# EAGLE design AtMega (EAGLE 9.5.2)
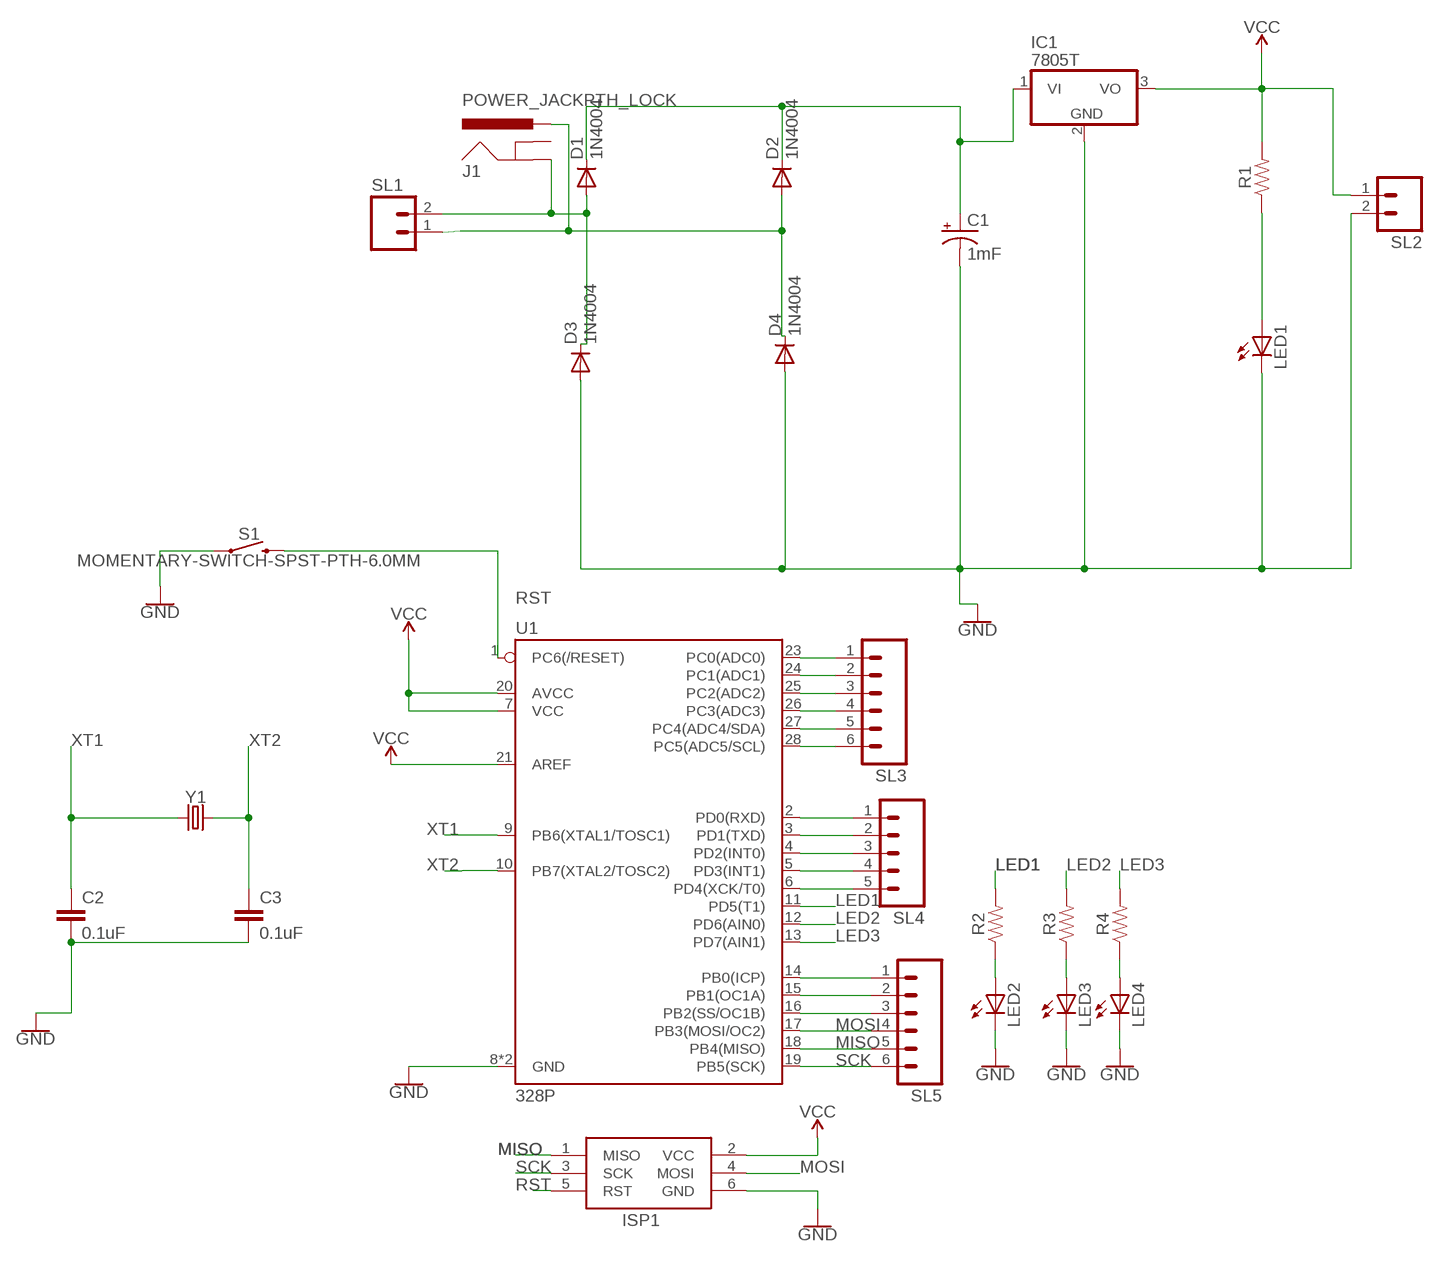
[diagram p0: schematic, sheet 1]

## Parts
C1  1mF  1000UF-RADIAL-5MM-25V-20%  [CPOL-RADIAL-5MM-10MM]
C2  0.1uF  0.1UF-KIT-EZ-50V-20%  [CAP-PTH-SMALL-KIT]
C3  0.1uF  0.1UF-KIT-EZ-50V-20%  [CAP-PTH-SMALL-KIT]
D1  1N4004  [DO41-10]
D2  1N4004  [DO41-10]
D3  1N4004  [DO41-10]
D4  1N4004  [DO41-10]
IC1  7805T  [TO220H]
ISP1  AVRISP-6  [AVRISP]
J1  POWER_JACKPTH_LOCK  [POWER_JACK_PTH_LOCK]
LED1  LED5MM  [LED5MM]
LED2  LED3MM  [LED3MM]
LED3  LED3MM  [LED3MM]
LED4  LED3MM  [LED3MM]
R1  RESISTORAXIAL-0.3  [AXIAL-0.3]
R2  RESISTORAXIAL-0.3  [AXIAL-0.3]
R3  RESISTORAXIAL-0.3  [AXIAL-0.3]
R4  RESISTORAXIAL-0.3  [AXIAL-0.3]
S1  MOMENTARY-SWITCH-SPST-PTH-6.0MM  [TACTILE_SWITCH_PTH_6.0MM]
SL1  M02  [02P]
SL2  M02  [02P]
SL3  M06  [06P]
SL4  M05  [05P]
SL5  M06  [06P]
U1  328P  ATMEGA328P_PDIP  [DIP28]
Y1  CRYSTALPTH-HC49US  [HC49US]

## Nets
GND: C1.- C2.2 C3.2 D3.A IC1.2(GND) ISP1.6(GND) LED1.K(C) LED2.K(C) LED3.K(C) LED4.K(C) S1.1 SL2.2 U1.8(GND) U1.22(GND)
LED1: R2.P$2 U1.11(PD5(T1))
LED2: R3.P$2 U1.12(PD6(AIN0))
LED3: R4.P$2 U1.13(PD7(AIN1))
MISO: ISP1.1(MISO) SL5.5 U1.18(PB4(MISO))
MOSI: ISP1.4(MOSI) SL5.4 U1.17(PB3(MOSI/OC2))
N$1: D2.A D4.C J1.PWR SL1.1
N$2: D4.A
N$3: SL5.3 U1.16(PB2(SS/OC1B))
N$4: LED4.A R4.P$1
N$5: C1.+ D1.C D2.C IC1.1(VI)
N$6: D1.A D3.C SL1.2
N$7: LED1.A R1.P$1
N$8: J1.GND
N$9: LED3.A R3.P$1
N$10: LED2.A R2.P$1
N$11: SL3.1 U1.23(PC0(ADC0))
N$12: SL3.2 U1.24(PC1(ADC1))
N$13: SL3.3 U1.25(PC2(ADC2))
N$14: SL3.4 U1.26(PC3(ADC3))
N$15: SL3.5 U1.27(PC4(ADC4/SDA))
N$16: SL3.6 U1.28(PC5(ADC5/SCL))
N$17: SL4.1 U1.2(PD0(RXD))
N$18: SL4.2 U1.3(PD1(TXD))
N$19: SL4.3 U1.4(PD2(INT0))
N$20: SL4.4 U1.5(PD3(INT1))
N$21: SL4.5 U1.6(PD4(XCK/T0))
N$22: SL5.1 U1.14(PB0(ICP))
N$23: SL5.2 U1.15(PB1(OC1A))
RST: ISP1.5(RST) S1.3 U1.1(PC6(/RESET))
SCK: ISP1.3(SCK) SL5.6 U1.19(PB5(SCK))
VCC: IC1.3(VO) ISP1.2(VCC) R1.P$2 SL2.1 U1.7(VCC) U1.20(AVCC) U1.21(AREF)
XT1: C2.1 U1.9(PB6(XTAL1/TOSC1)) Y1.1
XT2: C3.1 U1.10(PB7(XTAL2/TOSC2)) Y1.2
Unconnected: J1.GNDBREAK

## Library data of the parts
C1 = SparkFun-Capacitors:1000UF: 1,000µF/1mF ceramic capacitors A capacitor is a passive two-terminal electrical component used to store electrical energy temporarily in an electric field. CAP-08070; PROD_ID: CAP-09538
C2 C3 = SparkFun-Capacitors:0.1UF: 0.1µF ceramic capacitors A capacitor is a passive two-terminal electrical component used to store electrical energy temporarily in an electric field.; PROD_ID: CAP-08370
D1-D4 = adafruit:1N4004: DIODE General purpose 1N400x type rectifier (With bigger pads) http://www.ladyada.net/library/pcb/eaglelibrary.html
IC1 = adafruit:78*: Positive VOLTAGE REGULATOR Added bigger pads to the TO-92 package
ISP1 = adafruit:AVRISP: AVR ISP HEADER Standard 6 pin header for AVR programming
J1 = SparkFun-Connectors:POWER_JACK: Power Jack Connector This is the standard 5.5mm barrel jack for power. The PTH is the most common, proven, reliable, footprint. The Slot footprint only works if the mill layer is transmitted to the PCB fab house so be warned. Here are the connectors we sell at SparkFun: DC Barrel Power Jack/Connector <https://www.sparkfun.com/products/119> (PRT-00119) DC Barrel Power Jack/Connector (SMD) <https://www.sparkfun.com/products/12748> (PRT-12748) DC Barrel Jack Adapter - Breadboard Compatible <https://www.sparkfun.com/products/10811> (PRT-10811) It is used on this SparkFun product (and many, many others): SparkFun RedBoard - Programmed with Arduino <https://www.sparkfun.com/products/12757> (DEV-12757) Also, if you need a mating power supply or connector, please check these out: Wall Adapter Power Supply - 9VDC 650mA <https://www.sparkfun.com/products/298> (TOL-00298) DC Barrel Jack Adapter - Male <https://www.sparkfun.com/products/10287> (PRT-10287); PROD_ID: CONN-08197; SF_ID: PRT-00119
LED1-LED4 = adafruit:LED: LED OSRAM: - CHIPLED LG R971, LG N971, LY N971, LG Q971, LY Q971, LO R971, LY R971 LH N974, LH R974 LS Q976, LO Q976, LY Q976 LO Q996 - Hyper CHIPLED LW Q18S LB Q993, LB Q99A, LB R99A - SideLED LS A670, LO A670, LY A670, LG A670, LP A670 LB A673, LV A673, LT A673, LW A673 LH A674 LY A675 LS A676, LA A676, LO A676, LY A676, LW A676 LS A679, LY A679, LG A679 - Hyper Micro SIDELED® LS Y876, LA Y876, LO Y876, LY Y876 LT Y87S - SmartLED LW L88C, LW L88S LB L89C, LB L89S, LG L890 LS L89K, LO L89K, LY L89K LS L896, LA L896, LO L896, LY L896 - TOPLED LS T670, LO T670, LY T670, LG T670, LP T670 LSG T670, LSP T670, LSY T670, LOP T670, LYG T670 LG T671, LOG T671, LSG T671 LB T673, LV T673, LT T673, LW T673 LH T674 LS T676, LA T676, LO T676, LY T676, LB T676, LH T676, LSB T676, LW T676 LB T67C, LV T67C, LT T67C, LS T67K, LO T67K, LY T67K, LW E67C LS E67B, LA E67B, LO E67B, LY E67B, LB E67C, LV E67C, LT E67C LW T67C LS T679, LY T679, LG T679 LS T770, LO T770, LY T770, LG T770, LP T770 LB T773, LV T773, LT T773, LW T773 LH T774 LS E675, LA E675, LY E675, LS T675 LS T776, LA T776, LO T776, LY T776, LB T776 LHGB T686 LT T68C, LB T68C - Hyper Mini TOPLED® LB M676 - Mini TOPLED Santana® LG M470 LS M47K, LO M47K, LY M47K Source: http://www.osram.convergy.de/
R1-R4 = SparkFun-Resistors:RESISTOR: Generic Resistor Package
S1 = SparkFun-Switches:MOMENTARY-SWITCH-SPST: Momentary Switch (Pushbutton) - SPST Normally-open (NO) SPST momentary switches (buttons, pushbuttons). Variants PTH-12MM - 12mm square, through-hole Momentary Pushbutton Switch - 12mm Square <https://www.sparkfun.com/products/9190> (COM-09190) PTH-6.0MM, PTH-6.0MM-KIT - 6.0mm square, through-hole Mini Pushbutton Switch <https://www.sparkfun.com/products/97> (COM-00097) KIT package intended for soldering kit's - only one side of pads' copper is exposed. PTH-RIGHT-ANGLE-KIT - Right-angle, through-hole Right Angle Tactile Button <https://www.sparkfun.com/products/10791> - Used on SparkFun BigTime Watch Kit <https://www.sparkfun.com/products/11734> SMD-12MM - 12mm square, surface-mount Tactile Button - SMD (12mm) <https://www.sparkfun.com/products/12993> (COM-12993) Used on SparkFun PicoBoard <https://www.sparkfun.com/products/11888> SMD-4.5MM - 4.5mm Square Trackball Switch Used on SparkFun Blackberry Trackballer Breakout <https://www.sparkfun.com/products/13169> SMD-4.6MMX2.8MM - 4.60mm x 2.80mm, surface mount Used on SparkFun SAMD21 Mini Breakout <https://www.sparkfun.com/products/13664> SMD-5.2MM, SMD-5.2-REDUNDANT - 5.2mm square, surface-mount Mini Pushbutton Switch - SMD <https://www.sparkfun.com/products/8720> (COM-08720) Used on Arduino Pro Mini <https://www.sparkfun.com/products/11114> REDUNDANT package connects both switch circuits together SMD-6.0X3.5MM - 6.0 x 3.5mm, surface mount Momentary Reset Switch SMD <https://www.sparkfun.com/products/8229> (COM-08229) SMD-6.2MM-TALL - 6.2mm square, surface mount Tactile Button - SMD (6mm) <https://www.sparkfun.com/products/12992> Used on SparkFun Digital Sandbox <https://www.sparkfun.com/products/12651> SMD-RIGHT-ANGLE - Right-angle, surface mount Used on SparkFun Block for Intel® Edison - Arduino <https://www.sparkfun.com/products/13036>; PROD_ID: SWCH-08441; SF_SKU: COM-00097
SL1 SL2 = con-amp-quick:M02: AMP QUICK CONNECTOR; OC_FARNELL: unknown; OC_NEWARK: unknown
SL3 SL5 = con-amp-quick:M06: AMP QUICK CONNECTOR; OC_FARNELL: unknown; OC_NEWARK: unknown
SL4 = con-amp-quick:M05: AMP QUICK CONNECTOR; OC_FARNELL: unknown; OC_NEWARK: unknown
U1 = SparkFun-IC-Microcontroller:ATMEGA328P_PDIP: Atmel 328P Through hole ATMEGA328P uC used in the Arduino 32kb flash, 1k EEPROM, 2k SRAM Datasheet <http://www.sparkfun.com/datasheets/Components/SMD/ATMega328.pdf> SparkFun Products Storefront component: AVR 28 Pin 20MHz 32K 6A/D - ATMega328P <https://www.sparkfun.com/products/9061> (COM-09061) SparkFun Simon Says - Through-Hole Soldering Kit <https://www.sparkfun.com/products/10547> (KIT-10547) SparkFun Learn to Solder - Simon Says <https://www.sparkfun.com/products/13708> (KIT-13708) SparkFun BigTime Watch Kit <https://www.sparkfun.com/products/11734> (KIT-11734) SparkFun ClockIt <https://www.sparkfun.com/products/10930> (KIT-10930) SparkFun Serial Enabled LCD Kit <https://www.sparkfun.com/products/10097> (LCD-10097) SparkFun Simon Tilts - Through Hole Soldering Kit <https://www.sparkfun.com/products/12634> (KIT-12634) SparkFun Frequency Counter Kit <https://www.sparkfun.com/products/10140> (KIT-10140) FabFM Radio Kit <https://www.sparkfun.com/products/11043> (KIT-11043) SparkFun Binary Blaster Kit <https://www.sparkfun.com/products/12037> (KIT-12037) SparkFun Metro-Gnome <https://www.sparkfun.com/products/9236> (KIT-09236) ATmega328 with Arduino Optiboot (Uno) <https://www.sparkfun.com/products/10524> (DEV-10524); PROD_ID: IC-09136
Y1 = SparkFun-Clocks:CRYSTAL: Crystals (Generic) These are passive quartz crystals, which can be used as a clock source for a microcontroller. Crystal's are two-terminal devices. They require external "load" capacitors to generate an oscillating signal.

## Board
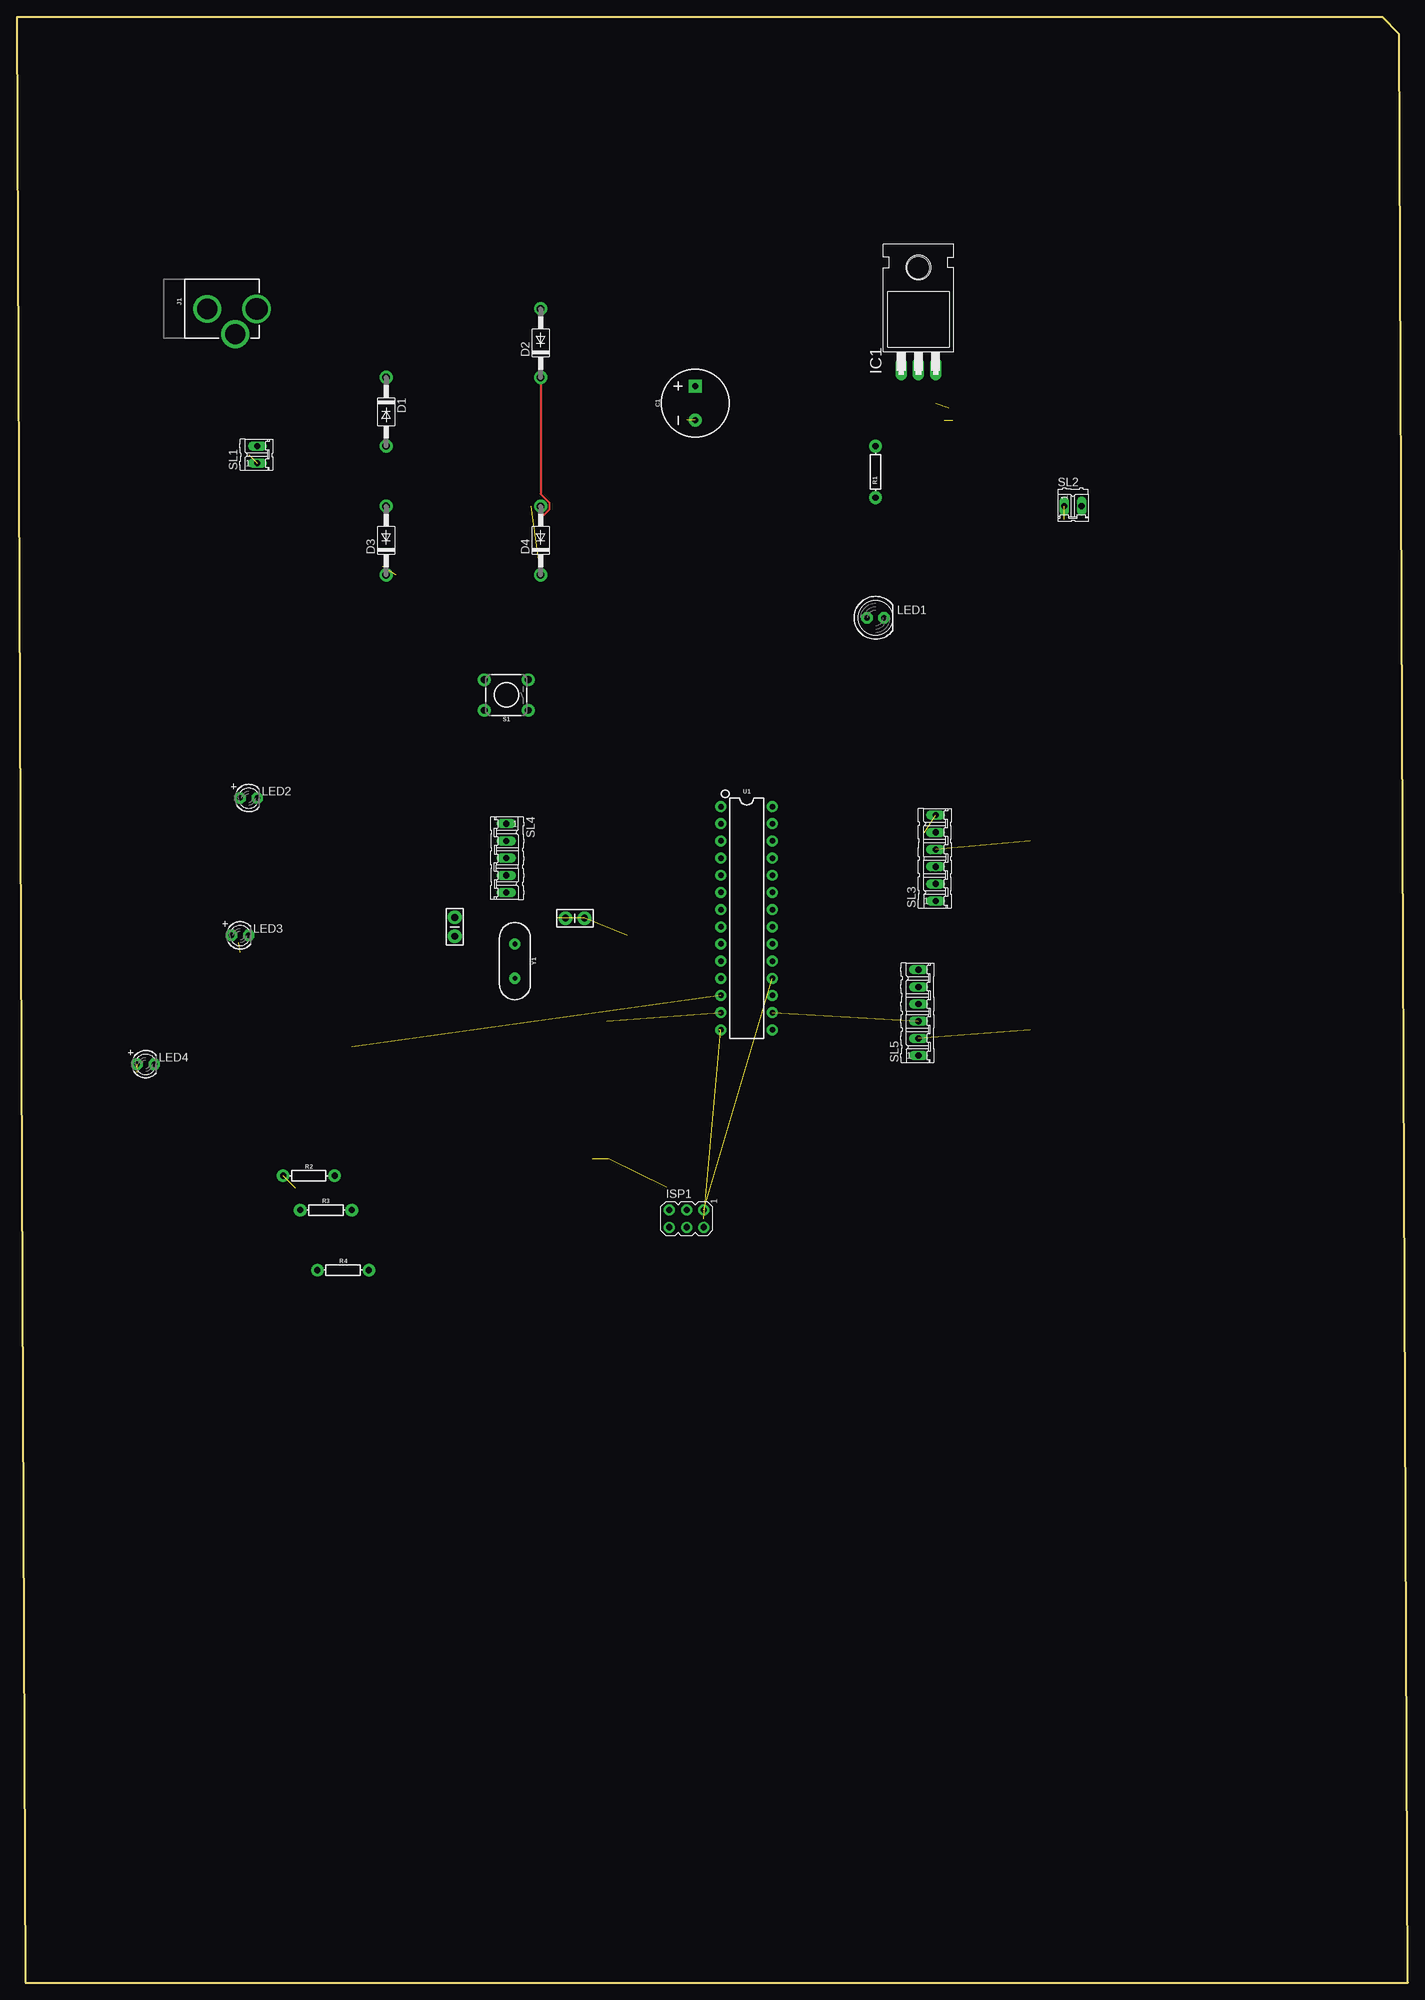
[diagram p1: board, top side]
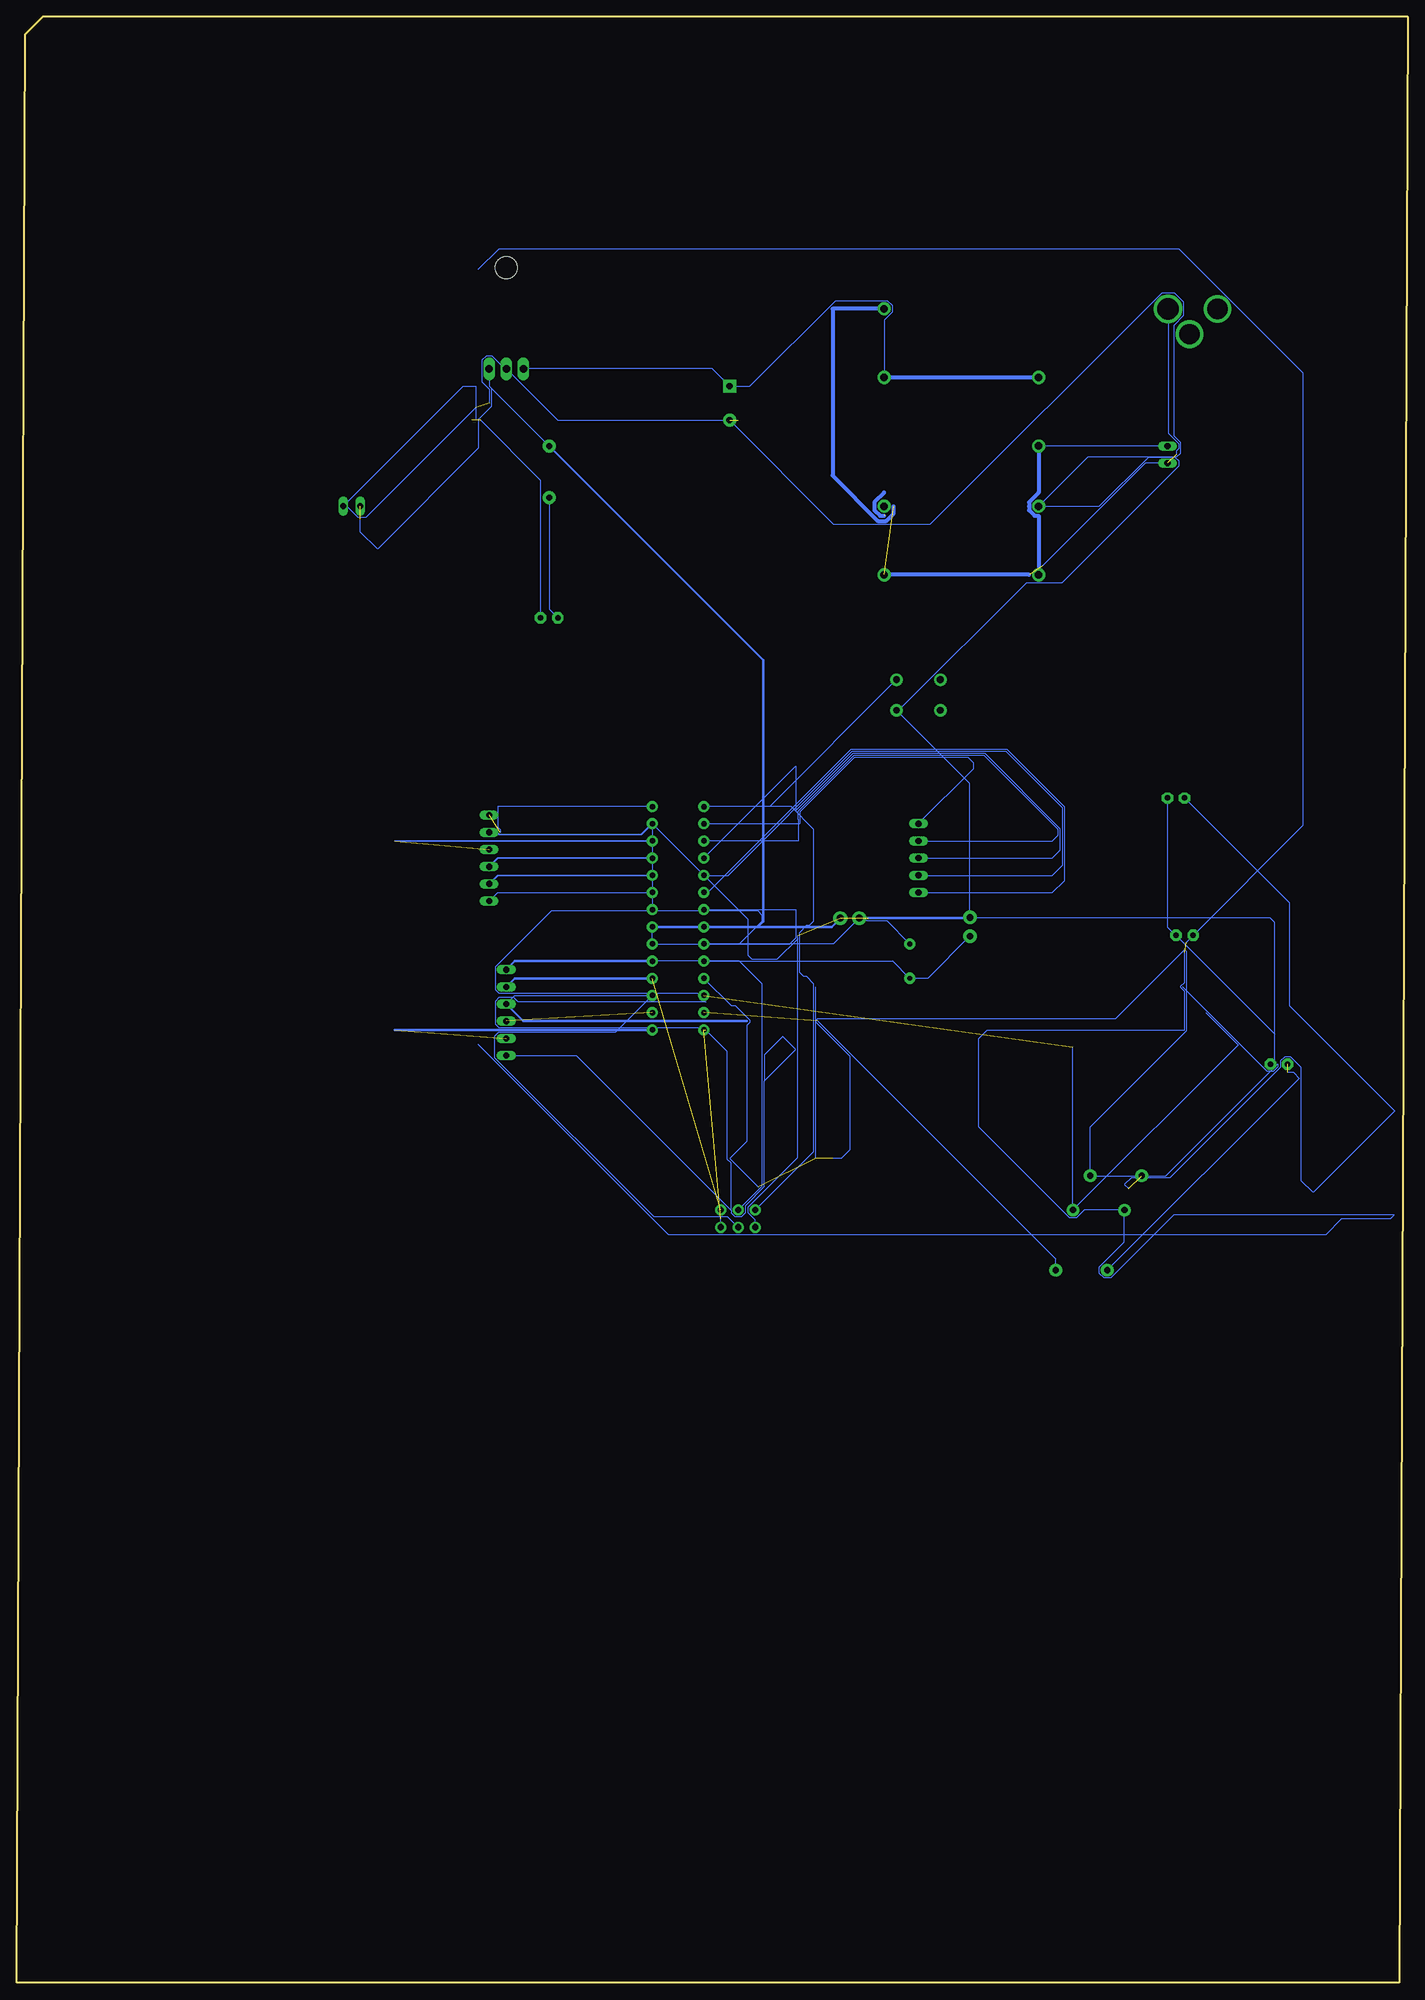
[diagram p2: board, bottom side, seen from below]

Size 205.74 x 290.83 mm. Coordinates in mm from the lower left corner, seen from the top.
Outline: 0,290.83 1.27,0 205.74,0 204.47,288.29 201.93,290.83 0,290.83
Copper layers (1*16): Top 0.035mm / dielectric 1.5mm / Bottom 0.035mm
Design rules "default": minimum track width 6mil, minimum drill 0.35mm, track to track 6mil, track to pad 6mil, pad to pad 6mil, via to via 6mil, smd to smd 6mil, copper to edge 40mil, drill to drill 6mil, minimum pad ring 10mil, minimum via ring 8mil, stop-mask expansion 4mil, vias tented up to drill 0mil, thermal gap 10mil

### Footprints (pad centres in the part's own frame; a part is rotated, then mirrored left to right if it is on the bottom)
CPOL-RADIAL-5MM-10MM = drill 0.9 pad 1.93 square: + 2.5,0 | drill 0.9 pad 1.93: - -2.5,0
CAP-PTH-SMALL-KIT = drill 1.016 pad 2.032: 1 -1.397,0; 2 1.397,0
DO41-10 = drill 1.118 pad 1.93: A 5.08,0; C -5.08,0
TO220H = drill 1.118 long: 1 -2.54,-10.16; 2 0,-10.16; 3 2.54,-10.16 | hole 3.302: 0,4.826
AVRISP = drill 0.9 pad 1.626: 1 -1.27,2.54; 2 1.27,2.54; 3 -1.27,0; 4 1.27,0; 5 -1.27,-2.54; 6 1.27,-2.54
POWER_JACK_PTH_LOCK = drill 2.997 pad 4.115: GND 0.025,6.557; GNDBREAK 3.762,10.7 | drill 3.2 pad 4.115: PWR 0,13.878
LED5MM = drill 0.813 pad 1.676 octagon: A -1.27,0; K 1.27,0
LED3MM = drill 0.813 pad 1.676 octagon: A -1.27,0; K 1.27,0
AXIAL-0.3 = drill 0.9 pad 1.88: P$1 -3.81,0; P$2 3.81,0
TACTILE_SWITCH_PTH_6.0MM = drill 1.016 pad 1.88: 1 -3.251,2.261; 2 3.251,2.261; 3 -3.251,-2.261; 4 3.251,-2.261
02P = drill 0.914 long: 1 -1.27,0; 2 1.27,0
06P = drill 0.914 long: 1 -6.35,0; 2 -3.81,0; 3 -1.27,0; 4 1.27,0; 5 3.81,0; 6 6.35,0
05P = drill 0.914 long: 1 -5.08,0; 2 -2.54,0; 3 0,0; 4 2.54,0; 5 5.08,0
DIP28 = drill 0.813 pad 1.626: 1 -16.51,-3.81; 2 -13.97,-3.81; 3 -11.43,-3.81; 4 -8.89,-3.81; 5 -6.35,-3.81; 6 -3.81,-3.81; 7 -1.27,-3.81; 8 1.27,-3.81; 9 3.81,-3.81; 10 6.35,-3.81; 11 8.89,-3.81; 12 11.43,-3.81; 13 13.97,-3.81; 14 16.51,-3.81; 15 16.51,3.81; 16 13.97,3.81; 17 11.43,3.81; 18 8.89,3.81; 19 6.35,3.81; 20 3.81,3.81; 21 1.27,3.81; 22 -1.27,3.81; 23 -3.81,3.81; 24 -6.35,3.81; 25 -8.89,3.81; 26 -11.43,3.81; 27 -13.97,3.81; 28 -16.51,3.81
HC49US = drill 0.7 pad 1.651: 1 -2.54,0; 2 2.54,0

### Placement (x,y rotation side)
C1  100.33,233.68 90 top
C2  82.55,157.48 0 top
C3  64.77,156.21 90 top
D1  54.61,232.41 270 top
D2  77.47,242.57 90 top
D3  54.61,213.36 90 top
D4  77.47,213.36 90 top
IC1  133.35,248.92 0 top
ISP1  99.06,113.03 270 top
J1  21.59,247.65 270 top
LED1  127,201.93 0 top
LED2  34.29,175.26 0 top
LED3  33.02,154.94 0 top
LED4  19.05,135.89 0 top
R1  127,223.52 90 top
R2  43.18,119.38 0 top
R3  45.72,114.3 0 top
R4  48.26,105.41 0 top
S1  72.39,190.5 180 top
SL1  35.56,226.06 90 top
SL2  156.21,218.44 0 top
SL3  135.89,166.37 90 top
SL4  72.39,166.37 270 top
SL5  133.35,143.51 90 top
U1  107.95,157.48 270 top
Y1  73.66,151.13 270 top

### Tracks (layer width: path | path; a pad name or v marks a point on that pad's centre or on a via)
GND  (6 unrouted)
  Bottom 0.152: 90.25,154.43 90.25,122.05 97.56,114.73 97.56,113.87 96.52,112.83 ISP1.6 | 90.25,154.43 90.25,154.94 | 90.25,154.43 93.32,151.36 96.95,151.36 97.56,151.97 97.56,157.25 111.76,171.45 U1.22 | C3.2 64.77,177.37 75.15,187.74 | 75.15,187.74 S1.1 | 19.68,140.34 LED3.K 35.56,156.21 LED2.K | 64.9,157.48 20.32,157.48 19.68,156.84 19.68,140.34 | LED4.K 19.68,136.53 19.68,140.34 | 100.33,231.14 84.91,215.72 70.7,215.72 36.44,249.99 34.5,249.99 33.13,248.62 33.13,246.68 34.58,245.24 34.58,228.82 33.6,227.85 33.6,226.31 34.16,225.75 47.3,225.75 D3.A 45.62,218.44 38.33,225.73 34.46,225.73 33.91,225.18 33.91,224.4 51.22,207.09 56.47,207.09 75.15,188.41 75.15,187.74 | 99.06,231.14 125.73,231.14 IC1.2 133.54,238.76 135.45,240.67 136.33,240.67 136.96,240.04 136.96,236.86 135.89,235.79 135.89,233.68 | 137.85,232.99 154.05,216.79 155.33,216.79 156.98,218.44 SL2.2 139.7,236.22 137.85,236.22 137.85,231.14 138.43,231.14 | LED1.K 128.27,222.25 137.16,231.14
  Bottom 0.406: C3.2 64.9,157.48 79.78,157.48 | U1.8 85.22,156.21 C2.2
LED1  (2 unrouted)
  Bottom 0.152: 33.26,147.32 20.76,134.82 19.88,134.82 19.25,135.45 19.25,135.93 35.8,119.38 R2.P$2 46.99,126.57 32.72,140.84 32.72,152.53 32.89,152.71 33.15,152.71 43.31,142.55 87.38,142.55 87.55,142.37 87.55,142.11 82.55,137.11 82.55,123.19 83.82,121.92 85.09,121.92 | 87.55,121.92 87.55,147.32 | U1.11 100.1,144.55 99.49,144.55 97.36,142.42 97.36,142.06 97.79,141.63 97.79,124.46 100.33,121.92 96.1,117.69
LED2  (1 unrouted)
  Bottom 0.152: 29.88,143.51 25.1,138.73 R3.P$2 49.53,138.43
LED3  (1 unrouted)
  Bottom 0.152: 87.25,142.24 52.07,107.06 R4.P$2
MISO  (1 unrouted)
  Bottom 0.406: SL5.5 132.08,148.59 U1.18
MOSI
  Bottom 0.152: SL5.4 132.08,146.05 U1.17 117.17,140.64 134.45,140.64 135.05,140.04 135.05,136.82 111.49,113.26 100.56,113.26 ISP1.4
  Bottom 0.406: SL5.4 130.81,142.24 97.79,142.24
N$1  (3 unrouted)
  Bottom 0.152: J1.PWR 35.47,229.28 33.91,227.72 33.91,226.94 34.29,226.56 34.29,226.06 | SL1.1 38.84,224.79 54.08,209.55
  Bottom 0.61: 56.03,208.28 D4.C | D2.A 85.09,247.65 85.09,222.97 78.38,216.26 77.15,216.26 76.05,217.36 76.05,218.44
N$3  (1 unrouted)
N$4  (1 unrouted)
  Bottom 0.152: 17.78,134.62 16.89,134.62 16.07,133.79 R4.P$1
N$5  (1 unrouted)
  Top 0.305: 77.47,217.17 78,217.17 78.74,217.91 78.74,218.97 77.47,220.24 D2.C
  Bottom 0.152: IC1.1 102.91,238.76 C1.+ 97.31,236.18 84.65,248.84 76.98,248.84 76.28,248.14 76.28,247.16 77.47,245.96 D2.C
  Bottom 0.61: 77.47,217.02 78.06,217.02 78.89,217.85 78.89,219.03 77.47,220.45 | D1.C D2.C
N$6
  Bottom 0.152: SL1.2 D1.A
  Bottom 0.61: D1.A 54.61,220.45 56.03,219.03 56.03,218.44 56.03,217.85 55.2,217.02 54.61,217.02 D3.C
N$7
  Bottom 0.152: R1.P$1 127,203.2 LED1.A
N$9  (1 unrouted)
  Bottom 0.152: 137.54,253.43 134.49,256.49 33.78,256.49 15.44,238.15 15.44,171.25 LED3.A 32.8,153.89 | 137.54,138.88 109.38,110.72 12.09,110.72 9.78,113.03 2.54,113.03 2.02,113.55 34.66,113.55 43.97,104.24 44.93,104.24 45.62,104.93 45.62,105.89 41.91,109.6 R3.P$1 47.88,114.3 49.05,113.13 50.01,113.13 63.5,126.62 63.5,139.7 62.23,140.97 33.02,140.97 33.02,146.65 33.56,147.19 33.56,147.45 33.02,147.99 33.02,152.4
N$10  (1 unrouted)
  Bottom 0.152: LED2.A 17.58,159.82 17.58,144.58 1.95,128.95 14.02,116.89 15.76,118.63 15.76,135.38 17.34,136.96 18.22,136.96 18.85,136.33 18.85,135.42 35.2,119.08 40.95,119.08 41.91,118.11 41.27,117.47
N$11
  Bottom 0.152: SL3.1 134.62,161.29 U1.23
N$12
  Bottom 0.203: SL3.2 134.62,163.83 U1.24
N$13
  Bottom 0.203: SL3.3 134.62,166.37 U1.25
N$14  (1 unrouted)
  Bottom 0.203: U1.26 149.86,168.91
N$15
  Bottom 0.203: U1.27 113.36,169.85 134.38,169.85 134.71,170.18 SL3.5
N$16  (1 unrouted)
  Bottom 0.152: U1.28 134.62,173.99 134.62,170.95 134.24,170.57 134.24,170.18
N$17
  Bottom 0.152: SL4.1 64.31,179.53 64.31,180.55 65,181.23 81.86,181.23 89.94,173.15 89.94,171.45 U1.2
N$18
  Bottom 0.152: SL4.2 52.57,168.91 51.69,169.79 51.69,170.57 62.65,181.53 81.99,181.53 90.25,173.28 90.25,172.14 90.17,172.06 90.17,168.91 U1.3
N$19
  Bottom 0.152: U1.4 90.55,179.96 90.55,173.4 82.12,181.84 62.53,181.84 51.38,170.7 51.38,167.56 52.57,166.37 SL4.3
N$20
  Bottom 0.152: U1.5 100.56,163.83 82.24,182.14 59.41,182.14 51.08,173.81 51.08,165.32 52.57,163.83 SL4.4
N$21
  Bottom 0.152: U1.6 103.53,161.29 82.37,182.45 59.28,182.45 50.78,173.94 50.78,163.09 52.57,161.29 SL4.5
N$22  (1 unrouted)
  Bottom 0.152: 95.17,133.43 95.17,117.75 98.02,114.91 98.02,113.87 98.63,113.26 99.49,113.26 100.1,113.87 100.1,114.27 | 95.17,133.43 90.55,138.05 92.46,139.95 95.17,137.24 95.17,133.43 | SL5.1 122.99,137.16 100.1,114.27 | 103.84,140.97 100.64,137.77 100.64,121.79 100.1,121.26 100.1,114.27
N$23  (1 unrouted)
  Bottom 0.406: U1.15 149.86,140.97
RST
  Bottom 0.152: ISP1.5 87.86,122.96 87.86,147.75 88.93,148.82 89.33,148.82 89.94,149.43 89.94,155.37 88.87,156.44 88.47,156.44 87.86,157.05 87.86,170.61 91.24,173.99 U1.1 94.41,173.99 S1.3
SCK
  Bottom 0.152: U1.19 98.86,151.13 95.48,147.75 95.48,117.88 ISP1.3
  Bottom 0.406: SL5.6 132.08,151.13 U1.19
VCC  (2 unrouted)
  Bottom 0.152: U1.20 U1.21 | U1.20 91.44,153.67 90.55,154.56 90.55,158.75 U1.7 | U1.20 98.86,153.67 95.48,157.05 95.48,157.91 96.09,158.52 126.73,158.52 135,150.25 135,146.93 134.45,146.38 105.13,146.38 103.84,145.09 131.62,145.09 132.25,145.72 134.45,145.72 135,145.17 135,141.85 134.45,141.3 104.47,141.3 104.14,140.97 | ISP1.2 101.6,112.95 | R1.P$2 135.59,235.92 | IC1.3 135.89,236.22 135.59,235.92 | 135.59,235.92 135.59,233.15 137.47,231.27 137.47,227.03 152.4,212.09 154.94,214.63 154.94,216.48
  Bottom 0.406: U1.21 96.14,156.21 95.35,157 95.35,195.68 R1.P$2
XT1
  Bottom 0.152: Y1.1 77.04,157.05 79.96,157.05 80.39,157.48 C2.1 84.96,153.67 U1.9
XT2
  Bottom 0.152: U1.10 76.2,151.13 Y1.2 70.99,148.59 C3.1